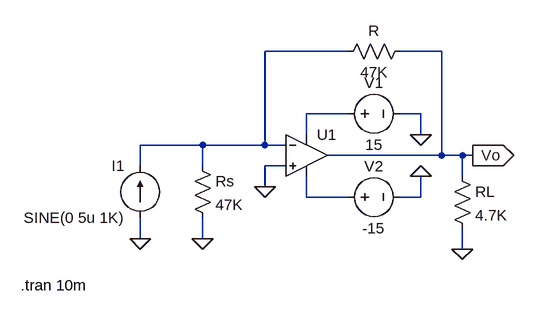
[diagram p0: schematic Run 2_A.asc]
Run 2_A.asc, the LTspice schematic file:
Version 4
SHEET 1 880 680
WIRE 192 16 64 16
WIRE 336 16 272 16
WIRE 192 112 128 112
WIRE 304 112 272 112
WIRE 128 144 128 112
WIRE 304 144 304 112
WIRE -32 160 -128 160
WIRE 64 160 64 16
WIRE 64 160 -32 160
WIRE 96 160 64 160
WIRE 336 176 336 16
WIRE 336 176 160 176
WIRE 368 176 336 176
WIRE 384 176 368 176
WIRE -128 192 -128 160
WIRE -32 192 -32 160
WIRE 96 192 64 192
WIRE 368 208 368 176
WIRE 64 224 64 192
WIRE 128 240 128 208
WIRE 192 240 128 240
WIRE 304 240 304 208
WIRE 304 240 272 240
WIRE -128 304 -128 272
WIRE -32 304 -32 272
WIRE 368 320 368 288
FLAG 304 144 0
FLAG 304 208 0
FLAG 64 224 0
FLAG 368 320 0
FLAG 384 176 Vo
IOPIN 384 176 Out
FLAG -32 304 0
FLAG -128 304 0
SYMBOL OpAmps\\UniversalOpamp2 128 176 R0
SYMATTR InstName U1
SYMBOL voltage 176 112 R270
WINDOW 0 32 56 VTop 2
WINDOW 3 -32 56 VBottom 2
WINDOW 123 0 0 Left 0
WINDOW 39 0 0 Left 0
SYMATTR InstName V1
SYMATTR Value 15
SYMBOL voltage 176 240 R270
WINDOW 0 32 56 VTop 2
WINDOW 3 -32 56 VBottom 2
WINDOW 123 0 0 Left 0
WINDOW 39 0 0 Left 0
SYMATTR InstName V2
SYMATTR Value -15
SYMBOL res 288 0 R90
WINDOW 0 0 56 VBottom 2
WINDOW 3 32 56 VTop 2
SYMATTR InstName R
SYMATTR Value 47K
SYMBOL res 352 192 R0
SYMATTR InstName RL
SYMATTR Value 4.7K
SYMBOL res -48 176 R0
SYMATTR InstName Rs
SYMATTR Value 47K
SYMBOL current -128 272 R180
WINDOW 0 24 80 Left 2
WINDOW 3 24 0 Left 2
WINDOW 123 0 0 Left 0
WINDOW 39 0 0 Left 0
SYMATTR InstName I1
SYMATTR Value SINE(0 5u 1K)
TEXT -312 376 Left 2 !.tran 10m

The netlist it stands for:
* Run 2_A.asc
XU1 0 N001 N002 N003 Vo level.2 Avol=1Meg GBW=10Meg Slew=10Meg ilimit=25m rail=0 Vos=0 phimargin=45 en=0 enk=0 in=0 ink=0 Rin=500Meg  ; pins IN+ IN- V+ V- OUT
V1 N002 0 15
V2 N003 0 -15
R Vo N001 47K
RL Vo 0 4.7K
Rs N001 0 47K
I1 0 N001 SINE(0 5u 1K)
.tran 10m
.lib UniversalOpamps2.sub
.backanno
.end